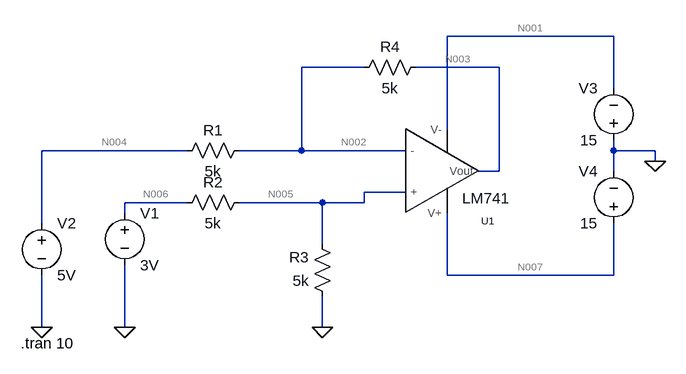
[diagram p0: schematic Differential amp.asc]
Differential amp.asc, the LTspice schematic file:
Version 4.1
SHEET 1 880 680
WIRE 736 -112 480 -112
WIRE 352 -64 256 -64
WIRE 560 -64 432 -64
WIRE 736 -32 736 -112
WIRE 480 32 480 -112
WIRE 80 64 -144 64
WIRE 256 64 256 -64
WIRE 256 64 160 64
WIRE 416 64 256 64
WIRE 736 64 736 48
WIRE 800 64 736 64
WIRE 800 80 800 64
WIRE 560 96 560 -64
WIRE 560 96 528 96
WIRE 736 96 736 64
WIRE 416 128 352 128
WIRE 80 144 -16 144
WIRE 288 144 160 144
WIRE 352 144 352 128
WIRE 352 144 288 144
WIRE -16 160 -16 144
WIRE -144 176 -144 64
WIRE 288 208 288 144
WIRE 480 256 480 160
WIRE 736 256 736 176
WIRE 736 256 480 256
WIRE -144 336 -144 256
WIRE -16 336 -16 240
WIRE 288 336 288 288
FLAG 800 80 0
FLAG 288 336 0
FLAG -16 336 0
FLAG -144 336 0
SYMBOL LM\ 741\\LM741 464 80 M180
WINDOW 3 76 -73 Top 2
SYMATTR InstName U1
SYMBOL res 176 48 R90
WINDOW 0 0 56 VBottom 2
WINDOW 3 32 56 VTop 2
SYMATTR InstName R1
SYMATTR Value 5k
SYMBOL res 176 128 R90
WINDOW 0 0 56 VBottom 2
WINDOW 3 32 56 VTop 2
SYMATTR InstName R2
SYMATTR Value 5k
SYMBOL res 304 304 R180
WINDOW 0 36 76 Left 2
WINDOW 3 36 40 Left 2
SYMATTR InstName R3
SYMATTR Value 5k
SYMBOL voltage -16 144 R0
WINDOW 123 0 0 Left 0
WINDOW 39 0 0 Left 0
SYMATTR InstName V1
SYMATTR Value 3V
SYMBOL voltage -144 160 R0
WINDOW 123 0 0 Left 0
WINDOW 39 0 0 Left 0
SYMATTR InstName V2
SYMATTR Value 5V
SYMBOL res 448 -80 R90
WINDOW 0 0 56 VBottom 2
WINDOW 3 32 56 VTop 2
SYMATTR InstName R4
SYMATTR Value 5k
SYMBOL voltage 736 64 R180
WINDOW 0 24 96 Left 2
WINDOW 3 24 16 Left 2
WINDOW 123 0 0 Left 0
WINDOW 39 0 0 Left 0
SYMATTR InstName V3
SYMATTR Value 15
SYMBOL voltage 736 192 R180
WINDOW 0 24 96 Left 2
WINDOW 3 24 16 Left 2
WINDOW 123 0 0 Left 0
WINDOW 39 0 0 Left 0
SYMATTR InstName V4
SYMATTR Value 15
TEXT -176 360 Left 2 !.tran 10

The netlist it stands for:
* Differential amp.asc
X§U1 N005 N002 N007 N001 N003 LM741  ; pins + - V+ V- Vout
R1 N002 N004 5k
R2 N005 N006 5k
R3 0 N005 5k
V1 N006 0 3V
V2 N004 0 5V
R4 N003 N002 5k
V3 0 N001 15
V4 N007 0 15
.tran 10
.lib C:\Users\Subodha\Desktop\Desk\2nd Semester\Electronics\LT Spices\Unity gain amplifier\LM 741\lm741.lib
.backanno
.end

* Results of the author's LTspice run, read from the files saved beside the schematic
* Operating Point, zero values left out:
*   V(n002) = 1.501 V
*   V(n001) = -15 V
*   V(n003) = -1.998 V
*   V(n006) = 3 V
*   V(n005) = 1.5 V
*   V(n007) = 15 V
*   V(n004) = 5 V
*   I(V1) = -300 µA
*   I(R4) = -699.7 µA
*   I(R1) = -699.8 µA
*   I(V3) = -2.33 mA
*   I(R2) = -300 µA
*   I(R3) = -300 µA
*   I(V2) = -699.8 µA
*   I(V4) = -1.63 mA
*   Ix(u1:1) = 57.73 nA
*   Ix(u1:2) = 102 nA
*   Ix(u1:99) = 1.63 mA
*   Ix(u1:50) = -2.33 mA
*   Ix(u1:28) = 699.7 µA